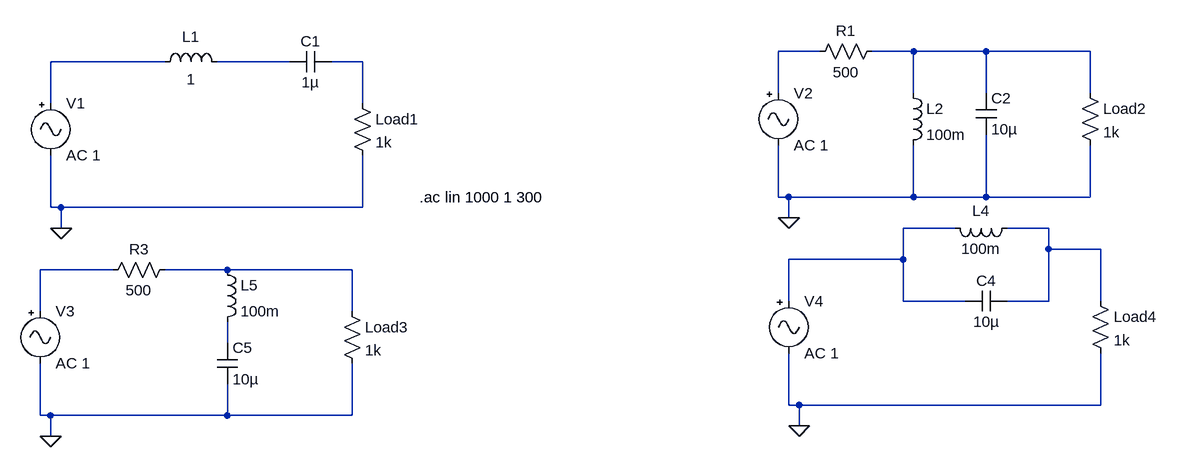
[diagram p0: schematic Resonance_filters.asc]
Resonance_filters.asc, the LTspice schematic file:
Version 4.1
SHEET 1 1776 680
WIRE 1248 16 1184 16
WIRE 1392 16 1328 16
WIRE 1504 16 1392 16
WIRE 1664 16 1504 16
WIRE 240 32 64 32
WIRE 432 32 320 32
WIRE 544 32 496 32
WIRE 1184 80 1184 16
WIRE 1392 80 1392 16
WIRE 1504 80 1504 16
WIRE 1664 80 1664 16
WIRE 64 96 64 32
WIRE 544 96 544 32
WIRE 1184 240 1184 160
WIRE 1200 240 1184 240
WIRE 1392 240 1392 160
WIRE 1392 240 1200 240
WIRE 1504 240 1504 144
WIRE 1504 240 1392 240
WIRE 1664 240 1664 160
WIRE 1664 240 1504 240
WIRE 64 256 64 176
WIRE 80 256 64 256
WIRE 544 256 544 176
WIRE 544 256 80 256
WIRE 1200 272 1200 240
WIRE 80 288 80 256
WIRE 1456 288 1376 288
WIRE 1600 288 1536 288
WIRE 1600 320 1600 288
WIRE 1680 320 1600 320
WIRE 1376 336 1376 288
WIRE 1376 336 1200 336
WIRE 160 352 48 352
WIRE 336 352 240 352
WIRE 528 352 336 352
WIRE 1200 400 1200 336
WIRE 1376 400 1376 336
WIRE 1472 400 1376 400
WIRE 1600 400 1600 320
WIRE 1600 400 1536 400
WIRE 1680 400 1680 320
WIRE 48 416 48 352
WIRE 528 416 528 352
WIRE 336 464 336 432
WIRE 1200 560 1200 480
WIRE 1216 560 1200 560
WIRE 1680 560 1680 480
WIRE 1680 560 1216 560
WIRE 48 576 48 496
WIRE 64 576 48 576
WIRE 336 576 336 528
WIRE 336 576 64 576
WIRE 528 576 528 496
WIRE 528 576 336 576
WIRE 1216 592 1216 560
WIRE 64 608 64 576
FLAG 80 288 0
FLAG 1200 272 0
FLAG 64 608 0
FLAG 1216 592 0
SYMBOL Misc\\signal 64 80 R0
WINDOW 123 0 0 Left 0
WINDOW 39 0 0 Left 0
SYMATTR InstName V1
SYMATTR Value AC 1
SYMBOL cap 432 48 R270
WINDOW 0 32 32 VTop 2
WINDOW 3 0 32 VBottom 2
SYMATTR InstName C1
SYMATTR Value 1µ
SYMBOL ind 224 48 R270
WINDOW 0 39 56 VTop 2
WINDOW 3 5 56 VBottom 2
SYMATTR InstName L1
SYMATTR Value 1
SYMATTR SpiceLine Rser=0
SYMBOL res 528 80 R0
SYMATTR InstName Load1
SYMATTR Value 1k
SYMBOL Misc\\signal 1184 64 R0
WINDOW 123 0 0 Left 0
WINDOW 39 0 0 Left 0
SYMATTR InstName V2
SYMATTR Value AC 1
SYMBOL cap 1488 80 R0
SYMATTR InstName C2
SYMATTR Value 10µ
SYMBOL ind 1376 64 R0
SYMATTR InstName L2
SYMATTR Value 100m
SYMATTR SpiceLine Rser=0
SYMBOL res 1648 64 R0
SYMATTR InstName Load2
SYMATTR Value 1k
SYMBOL res 1232 32 R270
WINDOW 0 32 56 VTop 2
WINDOW 3 0 56 VBottom 2
SYMATTR InstName R1
SYMATTR Value 500
SYMBOL Misc\\signal 48 400 R0
WINDOW 123 0 0 Left 0
WINDOW 39 0 0 Left 0
SYMATTR InstName V3
SYMATTR Value AC 1
SYMBOL res 512 400 R0
SYMATTR InstName Load3
SYMATTR Value 1k
SYMBOL Misc\\signal 1200 384 R0
WINDOW 123 0 0 Left 0
WINDOW 39 0 0 Left 0
SYMATTR InstName V4
SYMATTR Value AC 1
SYMBOL cap 1536 384 R90
WINDOW 0 0 32 VBottom 2
WINDOW 3 32 32 VTop 2
SYMATTR InstName C4
SYMATTR Value 10µ
SYMBOL ind 1552 272 R90
WINDOW 0 5 56 VBottom 2
WINDOW 3 32 56 VTop 2
SYMATTR InstName L4
SYMATTR Value 100m
SYMATTR SpiceLine Rser=0
SYMBOL res 1664 384 R0
SYMATTR InstName Load4
SYMATTR Value 1k
SYMBOL ind 320 336 R0
SYMATTR InstName L5
SYMATTR Value 100m
SYMATTR SpiceLine Rser=0
SYMBOL cap 320 464 R0
SYMATTR InstName C5
SYMATTR Value 10µ
SYMBOL res 144 368 R270
WINDOW 0 32 56 VTop 2
WINDOW 3 0 56 VBottom 2
SYMATTR InstName R3
SYMATTR Value 500
TEXT 632 240 Left 2 !.ac lin 1000 1 300

The netlist it stands for:
* Resonance_filters.asc
V1 N003 0 AC 1
C1 N004 N005 1µ
L1 N003 N004 1 Rser=0
R§Load1 N005 0 1k
V2 N001 0 AC 1
C2 N002 0 10µ
L2 N002 0 100m Rser=0
R§Load2 N002 0 1k
R1 N001 N002 500
V3 N008 0 AC 1
R§Load3 N009 0 1k
V4 N006 0 AC 1
C4 N007 N006 10µ
L4 N007 N006 100m Rser=0
R§Load4 N007 0 1k
L5 N009 N010 100m Rser=0
C5 N010 0 10µ
R3 N008 N009 500
.ac lin 1000 1 300
.backanno
.end